# Altium schematic sheet altium-nano-debug.SchDoc
size A3; SheetNumber: 1; SheetTotal: 1
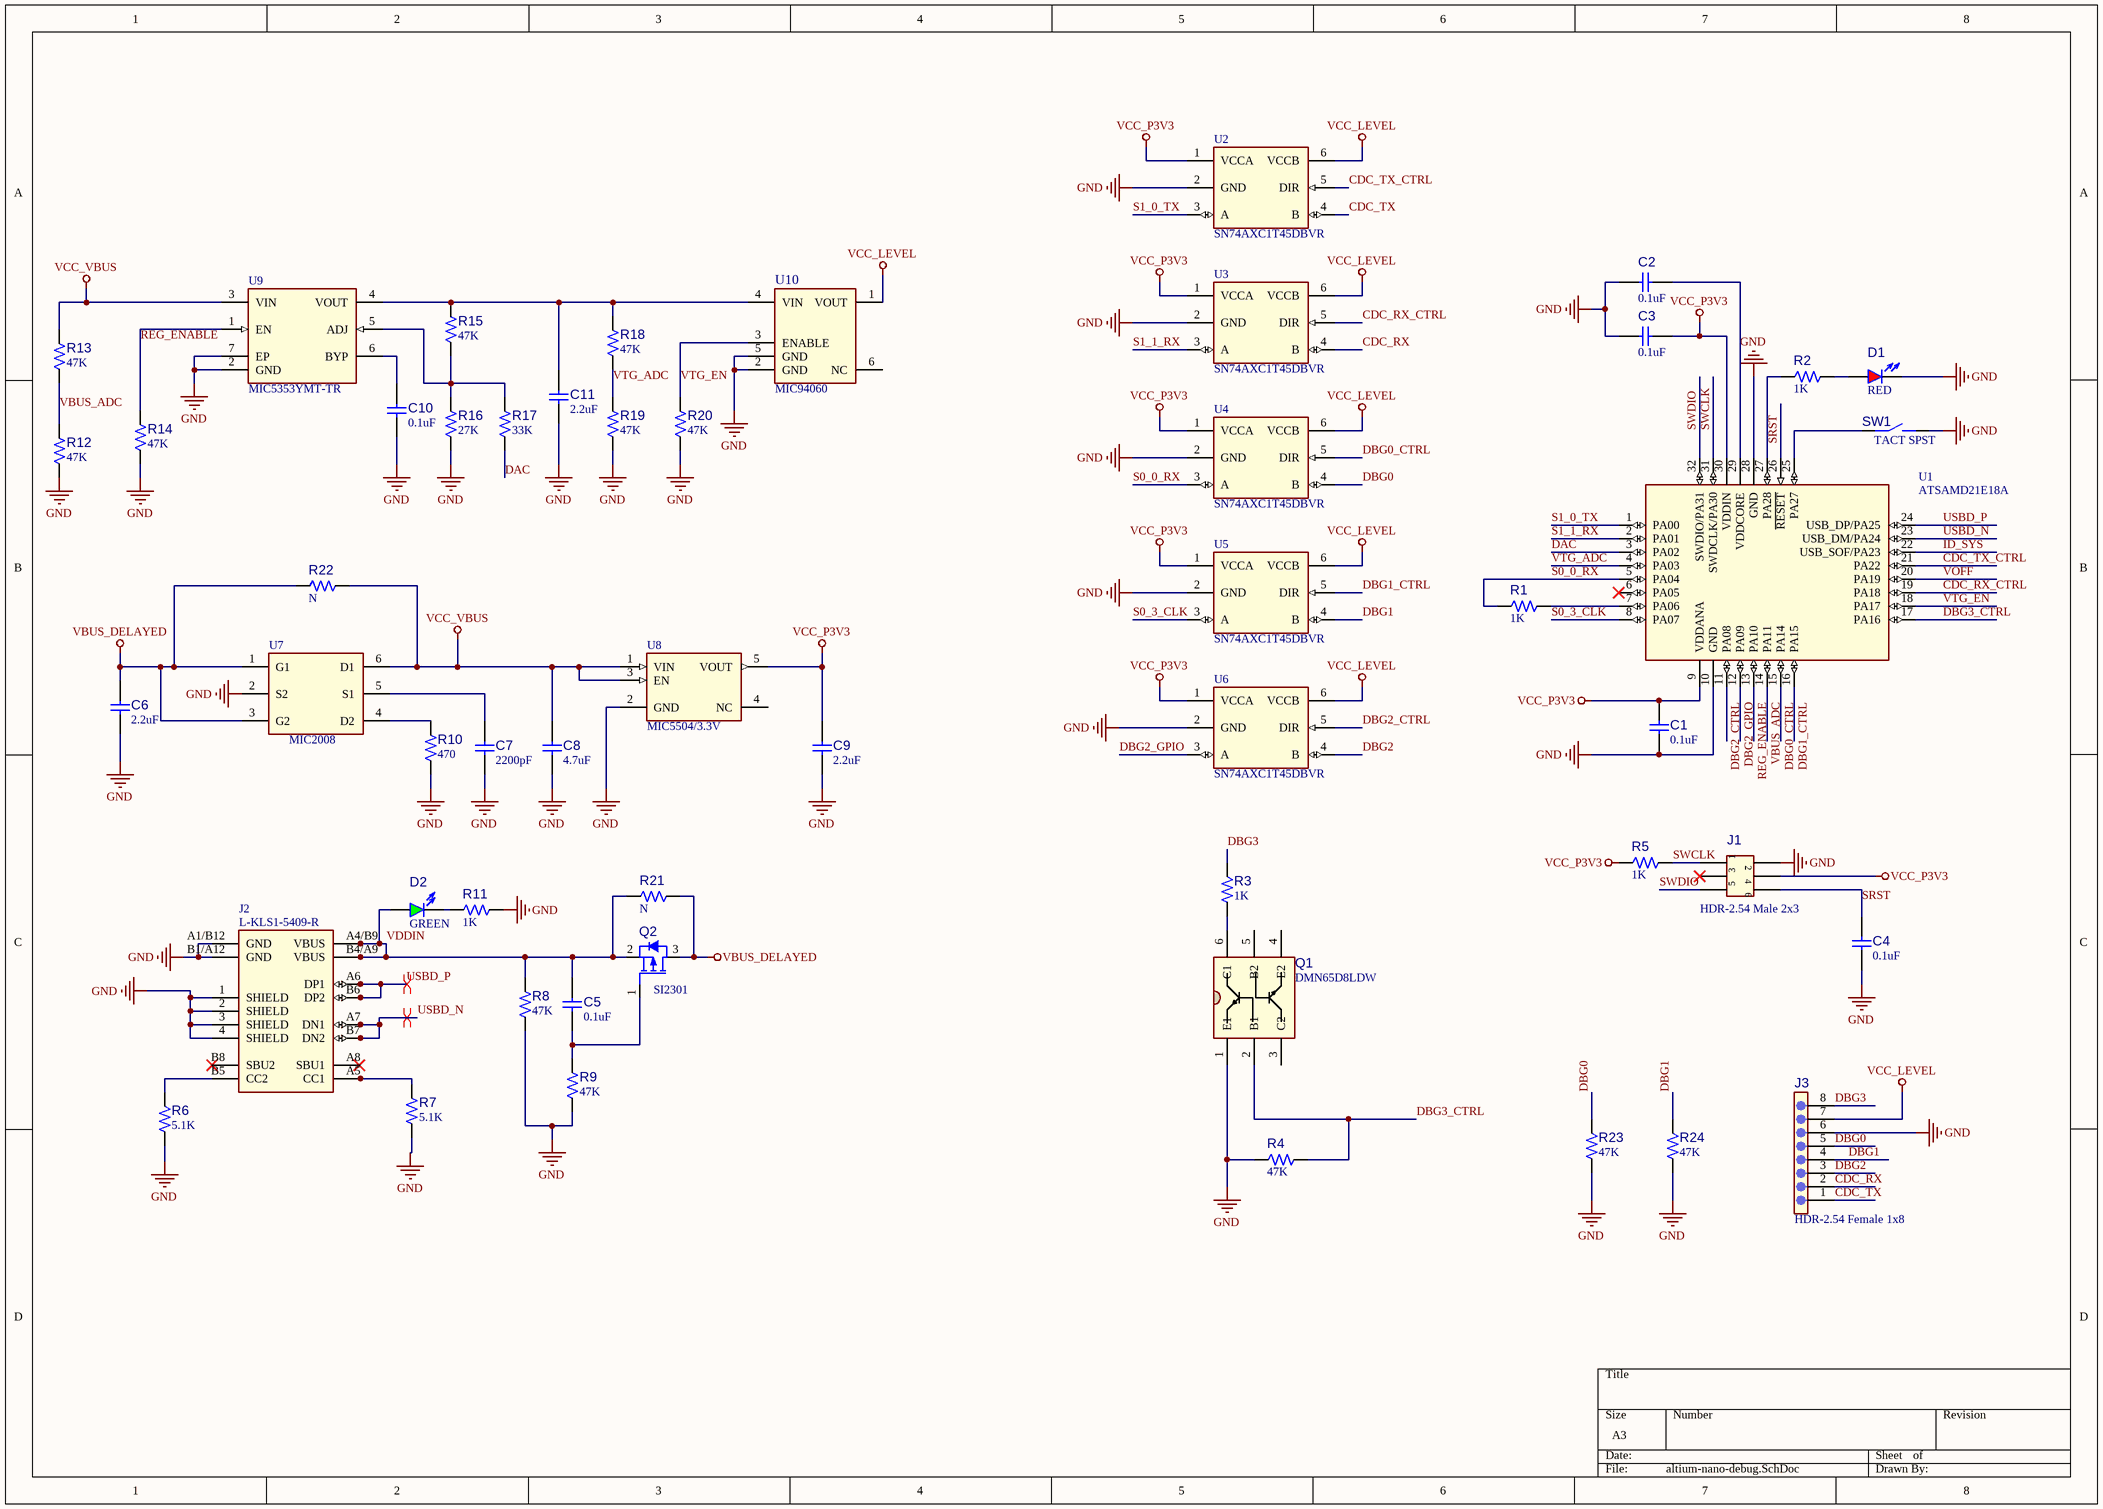
[diagram p0: altium-nano-debug.SchDoc]

## Parts
C1  value 0.1uF  [CAP_C_0603]  (hidden comment: Capacitor NP)
C2  value 0.1uF  [CAP_C_0603]  (hidden comment: Capacitor NP)
C3  value 0.1uF  [CAP_C_0603]  (hidden comment: Capacitor NP)
C4  value 0.1uF  [CAP_C_0603]  (hidden comment: Capacitor NP)
C5  value 0.1uF  [CAP_C_0603]  (hidden comment: Capacitor NP)
C6  value 2.2uF  [CAP_C_0603]  (hidden comment: Capacitor NP)
C7  value 2200pF  [CAP_C_0603]  (hidden comment: Capacitor NP)
C8  value 4.7uF  [CAP_C_0603]  (hidden comment: Capacitor NP)
C9  value 2.2uF  [CAP_C_0603]  (hidden comment: Capacitor NP)
C10  value 0.1uF  [CAP_C_0603]  (hidden comment: Capacitor NP)
C11  value 2.2uF  [CAP_C_0603]  (hidden comment: Capacitor NP)
D1  value RED  [LED_0603_Yellow]  (hidden comment: LED_red)
D2  value GREEN  [LED_0603_GREEN]  (hidden comment: LED_green)
J1  value HDR-2.54 Male 2x3  [HDR_M_2.54_2x3]  (hidden comment: Header 2x3)
J2  Manufacturer Part Number 1: L-KLS1-5409-R  [CON_USB2.0-C_RCPT_SMD_RA_KLS_KLS1-5409]  (hidden comment: CON USB2.0-C RCPT SMD RA KLS KLS1-5409)
J3  value HDR-2.54 Female 1x8  [HDR_F_2.54_1x8_RA]  (hidden comment: Header 1x8)
Q1  value DMN65D8LDW  [SOT-363]  (hidden comment: BC847BS-7-F SOT-363)
Q2  value SI2301  [SOT-23-3]  (hidden comment: Transistor MOS-P GSD)
R1  value 1K  [RES_C_0603]  (hidden comment: Resistor)
R2  value 1K  [RES_C_0603]  (hidden comment: Resistor)
R3  value 1K  [RES_C_0603]  (hidden comment: Resistor)
R4  value 47K  [RES_C_0603]  (hidden comment: Resistor)
R5  value 1K  [RES_C_0603]  (hidden comment: Resistor)
R6  value 5.1K  [RES_C_0603]  (hidden comment: Resistor)
R7  value 5.1K  [RES_C_0603]  (hidden comment: Resistor)
R8  value 47K  [RES_C_0603]  (hidden comment: Resistor)
R9  value 47K  [RES_C_0603]  (hidden comment: Resistor)
R10  value 470  [RES_C_0603]  (hidden comment: Resistor)
R11  value 1K  [RES_C_0603]  (hidden comment: Resistor)
R12  value 47K  [RES_C_0603]  (hidden comment: Resistor)
R13  value 47K  [RES_C_0603]  (hidden comment: Resistor)
R14  value 47K  [RES_C_0603]  (hidden comment: Resistor)
R15  value 47K  [RES_C_0603]  (hidden comment: Resistor)
R16  value 27K  [RES_C_0603]  (hidden comment: Resistor)
R17  value 33K  [RES_C_0603]  (hidden comment: Resistor)
R18  value 47K  [RES_C_0603]  (hidden comment: Resistor)
R19  value 47K  [RES_C_0603]  (hidden comment: Resistor)
R20  value 47K  [RES_C_0603]  (hidden comment: Resistor)
R21  value N  [RES_C_0603]  (hidden comment: Resistor)
R22  value N  [RES_C_0603]  (hidden comment: Resistor)
R23  value 47K  [RES_C_0603]  (hidden comment: Resistor)
R24  value 47K  [RES_C_0603]  (hidden comment: Resistor)
SW1  value TACT SPST  [SW_TACT_SMD_CK_KSR231GLFS]  (hidden comment: Switch 2 Pin)
U1  value ATSAMD21E18A  [TQFP-32_7x7]  (hidden comment: ATSAMD21E TQFP-32)
U2  value SN74AXC1T45DBVR  [SOT-23-6]  (hidden comment: SN74LVC1T45MDCKREP SC-70-6)
U3  value SN74AXC1T45DBVR  [SOT-23-6]  (hidden comment: SN74LVC1T45MDCKREP SC-70-6)
U4  value SN74AXC1T45DBVR  [SOT-23-6]  (hidden comment: SN74LVC1T45MDCKREP SC-70-6)
U5  value SN74AXC1T45DBVR  [SOT-23-6]  (hidden comment: SN74LVC1T45MDCKREP SC-70-6)
U6  value SN74AXC1T45DBVR  [SOT-23-6]  (hidden comment: SN74LVC1T45MDCKREP SC-70-6)
U7  value MIC2008  [SOT-23-6]  (hidden comment: AM3906N SOT23-6)
U8  value MIC5504/3.3V  [SOT-23-5]  (hidden comment: MIC55XX-X.X SOT23-5)
U9  value MIC5353YMT-TR  [MLF-6 1.6X1.6mm]  (hidden comment: MIC53XX ADJ MLF-6)
U10  value MIC94060  [SC-70-6]  (hidden comment: MIC94060Y-SC70-6)

## Nets
GND: C1.1 C2.1 C3.1 C4.1 C6.2 C7.2 C8.2 C9.2 C10.2 C11.2 D1.2(K) J1.2 J2.1(SHIELD) J2.2(SHIELD) J2.3(SHIELD) J2.4(SHIELD) J2.A1/B12(GND) J2.B1/A12(GND) J3.6 Q1.1(E1) R4.1 R6.2 R7.2 R8.1 R9.1 R10.1 R11.1 R12.1 R14.1 R16.1 R19.1 R20.1 R23.1 R24.1 SW1.2 U1.10(GND) U1.28(GND) U2.2(GND) U3.2(GND) U4.2(GND) U5.2(GND) U6.2(GND) U7.2(S2) U8.2(GND) U9.2(GND) U9.7(EP) U10.2(GND) U10.5(GND)
VBUS_DELAYED: C6.1 Q2.3(D) R21.1 R22.2 U7.1(G1) U7.3(G2)
VCC_LEVEL: J3.7 U2.6(VCCB) U3.6(VCCB) U4.6(VCCB) U5.6(VCCB) U6.6(VCCB) U10.1(VOUT)
VCC_P3V3: C1.2 C3.2 C9.1 J1.4 R5.2 U1.9(VDDANA) U1.30(VDDIN) U2.1(VCCA) U3.1(VCCA) U4.1(VCCA) U5.1(VCCA) U6.1(VCCA) U8.5(VOUT)
VCC_VBUS: C8.1 R13.2 R22.1 U7.6(D1) U8.1(VIN) U8.3(EN) U9.3(VIN)
CDC_RX: J3.2 U3.4(B)
CDC_RX_CTRL: U1.19(PA18) U3.5(DIR)
CDC_TX: J3.1 U2.4(B)
CDC_TX_CTRL: U1.21(PA22) U2.5(DIR)
DAC: R17.2 U1.3(PA02)
DBG0: J3.5 R23.2 U4.4(B)
DBG0_CTRL: U1.15(PA14) U4.5(DIR)
DBG1: J3.4 R24.2 U5.4(B)
DBG1_CTRL: U1.16(PA15) U5.5(DIR)
DBG2: J3.3 U6.4(B)
DBG2_CTRL: U1.11(PA08) U6.5(DIR)
DBG2_GPIO: U1.12(PA09) U6.3(A)
DBG3: J3.8 R3.2
DBG3_CTRL: Q1.2(B1) R4.2 U1.17(PA16)
ID_SYS: U1.22(USB_SOF/PA23)
REG_ENABLE: R14.2 U1.13(PA10) U9.1(EN)
S0_0_RX: R1.1 U1.5(PA04) U4.3(A)
S0_3_CLK: U1.8(PA07) U5.3(A)
S1_0_TX: U1.1(PA00) U2.3(A)
S1_1_RX: U1.2(PA01) U3.3(A)
SRST: C4.2 J1.6 U1.26(~{RESET})
SWCLK: J1.1 R5.1 U1.31(SWDCLK/PA30)
SWDIO: J1.5 U1.32(SWDIO/PA31)
USBD_N: J2.A7(DN1) J2.B7(DN2) U1.23(USB_DM/PA24)
USBD_P: J2.A6(DP1) J2.B6(DP2) U1.24(USB_DP/PA25)
VBUS_ADC: R12.2 R13.1 U1.14(PA11)
VDDIN: C5.1 D2.1(A) J2.A4/B9(VBUS) J2.B4/A9(VBUS) Q2.2(S) R8.2 R21.2
VOFF: U1.20(PA19)
VTG_ADC: R18.1 R19.2 U1.4(PA03)
VTG_EN: R20.2 U1.18(PA17) U10.3(ENABLE)
NetC2_2: C2.2 U1.29(VDDCORE)
NetC5_2: C5.2 Q2.1(G) R9.2
NetC7_1: C7.1 U7.5(S1)
NetC10_1: C10.1 U9.6(BYP)
NetC11_1: C11.1 R15.2 R18.2 U9.4(VOUT) U10.4(VIN)
NetD1_1: D1.1(A) R2.1
NetD2_2: D2.2(K) R11.2
NetJ2_A5: J2.A5(CC1) R7.1
NetJ2_B5: J2.B5(CC2) R6.1
NetQ1_6: Q1.6(C1) R3.1
NetR1_2: R1.2 U1.7(PA06)
NetR2_2: R2.2 U1.27(PA28)
NetR10_2: R10.2 U7.4(D2)
NetR15_1: R15.1 R16.2 R17.1 U9.5(ADJ)
NetSW1_1: SW1.1 U1.25(PA27)

Not connected (* = marked no-connect by the designer): J1 3*; J2 A8(SBU1) B8(SBU2)*; Q1 3(C2) 4(E2) 5(B2); U1 6(PA05)*; U8 4(NC); U10 6(NC)

## Layout directives
differential pair: USBD_N, USBD_P

## Library data of the parts
C1-C11 = CAP0455: Manufacturer 1: KYOCERA AVX; Manufacturer Part Number 1: 06035G104ZAT2A; Description_: CAP CER 0.1uF 50V 20% Y5V SMD 0603; Dev Tools Status: Production; Tolerance: 20%; Temperature Coefficient: Y5V; Type: Ceramic; Populated: Yes; Restricted Sourcing: No; MCHP-ID: CAP0455; Revision: 4; Symbol: Capacitor NP; Status: MCL Design; ComponentLink1URL: https://chn-vm-apps.microchip.com/mchprepo/parts/Datasheets/ECJ__General_.pdf; ComponentLink1Description: SVN Datasheet; ComponentLink2URL: C:\ALTIUM_WORK\00001_MCHP-CDB\Datasheets\ECJ__General_.pdf; ComponentLink2Description: Local Datasheet; ComponentLink3URL: C:\ALTIUM_WORK\00001_MCHP-CDB\Library\LibraryRefs\Capacitor NP.SchLib; ComponentLink3Description: Open Symbol; ComponentLink4URL: C:\ALTIUM_WORK\00001_MCHP-CDB\Library\Footprints\CAP_C_0603.PcbLib; ComponentLink4Description: Open Footprint; ComponentLink5Description: Open Footprint 2; ComponentLink6Description: Open Footprint 3; ComponentLink7Description: Open Footprint 4; Operating Temperature: -30C to +85C; Category: Capacitor; Manufacturer 2: Yageo; Manufacturer Part Number 2: CC0603ZRY5V9BB104; Supplier 1: Digi-Key; Supplier Part Number 1: 478-3724-1-ND; Supplier 2: Digi-Key; Supplier Part Number 2: 311-1343-6-ND; Supplier 3: Digi-Key; Supplier Part Number 3: 311-1343-2-ND; Quantity Override: 1
D1 = LED0049: LED; Manufacturer 1: Lite-On; Manufacturer Part Number 1: LTST-C150EKT; Description_: DIO LED RED 2V 30mA 6mcd Clear SMD 1206; Dev Tools Status: Production; Type: LED Single; Forward Current: 30mA; Power: 100mW; Reverse Current: 100uA; Reverse Voltage: 5V; Populated: YES; Restricted Sourcing: No; MCHP-ID: LED0049; Revision: 2; Symbol: LED_red; Status: MCL Design; Package: 1206; ComponentLink1URL: https://chn-vm-apps.microchip.com/mchprepo/parts/Datasheets/LTST-C150EKT.pdf; ComponentLink1Description: SVN Datasheet; ComponentLink2URL: C:\ALTIUM_WORK\00001_MCHP-CDB\Datasheets\LTST-C150EKT.pdf; ComponentLink2Description: Local Datasheet; ComponentLink3URL: C:\ALTIUM_WORK\00001_MCHP-CDB\Library\LibraryRefs\LED_red.SchLib; ComponentLink3Description: Open Symbol; ComponentLink4URL: C:\ALTIUM_WORK\00001_MCHP-CDB\Library\Footprints\LED_1206_Red.PcbLib; ComponentLink4Description: Open Footprint; ComponentLink5Description: Open Footprint 2; ComponentLink6Description: Open Footprint 3; ComponentLink7Description: Open Footprint 4; Operating Temperature: -55C to +85C; Category: Diode; Manufacturer 2: Kingbright; Manufacturer Part Number 2: KPC-3216EC-10MAV; Supplier 1: Digi-Key; Supplier Part Number 1: 160-1168-2-ND; Supplier 2: Kingbright; Supplier Part Number 2: KPC-3216EC-10MAV; Quantity Override: 1
D2 = DIODE1815: LED; Manufacturer 1: Vishay; Manufacturer Part Number 1: TLMP1100-GS08; Description_: DIO LED GREEN 2.1V 20mA SMD 0603 AEC-Q101; Dev Tools Status: Production; Forward Current: 20mA; Power: 90mW; Reverse Voltage: 12V; Owner: Severino Balong Jr.; Populated: YES; Restricted Sourcing: No; MCHP-ID: DIODE1815; Revision: 3; Symbol: LED_green; Status: MCL Design; Package: 0603; ComponentLink1URL: https://chn-vm-apps.microchip.com/mchprepo/parts/Datasheets/tlmx1100.pdf; ComponentLink1Description: SVN Datasheet; ComponentLink2URL: C:\ALTIUM_WORK\00001_MCHP-CDB\Datasheets\tlmx1100.pdf; ComponentLink2Description: Local Datasheet; ComponentLink3URL: C:\ALTIUM_WORK\00001_MCHP-CDB\Library\LibraryRefs\LED_green.SchLib; ComponentLink3Description: Open Symbol; ComponentLink4URL: C:\ALTIUM_WORK\00001_MCHP-CDB\Library\Footprints\LED_0603_GREEN.PcbLib; ComponentLink4Description: Open Footprint; ComponentLink5Description: Open Footprint 2; ComponentLink6Description: Open Footprint 3; ComponentLink7Description: Open Footprint 4; Operating Temperature: -40C to +100C; Category: Diode; Supplier 1: Digi-Key; Supplier Part Number 1: 751-1176-2-ND; Quantity Override: 1
J1 = CON0039: MCHP-ID: CON0039
J2 = CON2580: Manufacturer 1: KLS Electronic; Value: USB2.0 Type-C FEMALE; Description_: CON USB2.0 Type-C Female SMD R/A; Voltage: 100V AC; Current: 5A; Populated: YES; Restricted Sourcing: No; Revision: 2; Symbol: CON USB2.0-C RCPT SMD RA KLS KLS1-5409; Type: USB; Category: Connector; Supplier 1: Cabcon A/S; Supplier Part Number 1: L-KLS1-5409-R; Operating Temperature: -30C to +85C; Assembly Type: SMD
J3 = CON1288: Manufacturer 1: Sullins Connector Solutions; Manufacturer Part Number 1: PPPC081LGBN-RC; Description_: CON HDR-2.54 Female 1x8 Gold TH R/A; Dev Tools Status: Production; Owner: Bogdan Popescu; Populated: YES; Restricted Sourcing: No; MCHP-ID: CON1288; Revision: 4; Symbol: Header 1x8; Status: MCL Design; ComponentLink1URL: https://chn-vm-apps.microchip.com/mchprepo/parts/Datasheets/78_P(N)PxCxx1LGBN-RC,_10493-F.pdf; ComponentLink1Description: SVN Datasheet; ComponentLink2URL: C:\ALTIUM_WORK\00001_MCHP-CDB\Datasheets\78_P(N)PxCxx1LGBN-RC,_10493-F.pdf; ComponentLink2Description: Local Datasheet; ComponentLink3URL: C:\ALTIUM_WORK\00001_MCHP-CDB\Library\LibraryRefs\Header 1x8.SchLib; ComponentLink3Description: Open Symbol; ComponentLink4URL: C:\ALTIUM_WORK\00001_MCHP-CDB\Library\Footprints\HDR_F_2.54_1x8_RA.PcbLib; ComponentLink4Description: Open Footprint; ComponentLink5Description: Open Footprint 2; ComponentLink6Description: Open Footprint 3; ComponentLink7Description: Open Footprint 4; Type: Header 2.54mm; Category: Connector; Manufacturer 2: Greenconn Technology (Shenzhen) Co., Ltd.; Manufacturer Part Number 2: 2521 08 0001 2224; Manufacturer 3: SHENZHEN JUNHAO ENGINEERING; Manufacturer Part Number 3: R-212-0820-0021-000; Supplier 1: Digi-Key; Supplier Part Number 1: S5483-ND; Supplier 2: Greenconn Technology (Shenzhen) Co., Ltd.; Supplier Part Number 2: 2521 08 0001 2224; Supplier 3: SHENZHEN JUNHAO ENGINEERING; Supplier Part Number 3: R-212-0820-0021-000; Quantity Override: 1
Q1 = TRA1406: ADC; Manufacturer 1: Diodes Incorporated; Description_: TRANS 2NPN 45V 0.1A SOT363; Dev Tools Status: Design; Current: 100mA; Drain to Source Voltage: 5V; Gate to Source Voltage: 45V; Power: 200mW; Owner: Jose Garcia; Populated: YES; Restricted Sourcing: No; MCHP-ID: TRA1406; Revision: 1; Symbol: BC847BS-7-F SOT-363; Status: MCL Design; Package: SOT-363; ComponentLink1URL: https://chn-vm-apps.microchip.com/mchprepo/parts/Datasheets/https://www.diodes.com/assets/Datasheets/ds30222.pdf; ComponentLink1Description: SVN Datasheet; ComponentLink2URL: C:\ALTIUM_WORK\00001_MCHP-CDB\Datasheets\https://www.diodes.com/assets/Datasheets/ds30222.pdf; ComponentLink2Description: Local Datasheet; ComponentLink3URL: C:\ALTIUM_WORK\00001_MCHP-CDB\Library\LibraryRefs\BC847BS-7-F SOT-363.SchLib; ComponentLink3Description: Open Symbol; ComponentLink4URL: C:\ALTIUM_WORK\00001_MCHP-CDB\Library\Footprints\SOT-363.PcbLib; ComponentLink4Description: Open Footprint; ComponentLink5Description: Open Footprint 2; ComponentLink6Description: Open Footprint 3; ComponentLink7Description: Open Footprint 4; Operating Temperature: -65°C ~ 150°C (TJ); Category: Transistor; Manufacturer Part Number 1: BC847BS-7-F; Supplier 1: Digi-Key; Supplier Part Number 1: BC847BS-7FDICT-ND; Quantity Override: 1
Q2 = TRA0048: Transistor MOS; Manufacturer 1: Infineon; Manufacturer Part Number 1: IRLML6402TRPBF; Description_: TRANS FET P-CH IRLML6402 -20V -3.7A 1.3W SOT-23-3; Dev Tools Status: Production; Type: FET; Current: -3.7A; Drain to Source Voltage: -20V; Gate to Source Voltage: 12V; Power: 1.3W; Populated: YES; MCHP-ID: TRA0048; Revision: 3; Symbol: Transistor MOS-P GSD; Status: MCL Design; Package: SOT-23-3; ComponentLink1URL: https://chn-vm-apps.microchip.com/mchprepo/parts/Datasheets/irlml6402.pdf; ComponentLink1Description: SVN Datasheet; ComponentLink2URL: C:\ALTIUM_WORK\00001_MCHP-CDB\Datasheets\irlml6402.pdf; ComponentLink2Description: Local Datasheet; ComponentLink3URL: C:\ALTIUM_WORK\00001_MCHP-CDB\Library\LibraryRefs\Transistor MOS-P GSD.SchLib; ComponentLink3Description: Open Symbol; ComponentLink4URL: C:\ALTIUM_WORK\00001_MCHP-CDB\Library\Footprints\SOT-23-3.PcbLib; ComponentLink4Description: Open Footprint; ComponentLink5Description: Open Footprint 2; ComponentLink6Description: Open Footprint 3; ComponentLink7Description: Open Footprint 4; Operating Temperature: -55C to +150C; Category: Transistor; Supplier 1: Digi-Key; Supplier Part Number 1: IRLML6402PBFTR-ND; Quantity Override: 1
R1-R24 = RES0193: Manufacturer 1: Vishay; Manufacturer Part Number 1: CRCW0603100RJNEA; Description_: RES TKF 100R 5% 1/10W SMD 0603; Dev Tools Status: Production; Voltage: 50V; Temperature Coefficient: 100ppm/C; Power: 1/10W; Populated: Yes; MCHP-ID: RES0193; Revision: 2; Symbol: Resistor; Status: MCL Design; ComponentLink1URL: https://chn-vm-apps.microchip.com/mchprepo/parts/Datasheets/mcr_a.pdf; ComponentLink1Description: SVN Datasheet; ComponentLink2URL: C:\ALTIUM_WORK\00001_MCHP-CDB\Datasheets\mcr_a.pdf; ComponentLink2Description: Local Datasheet; ComponentLink3URL: C:\ALTIUM_WORK\00001_MCHP-CDB\Library\LibraryRefs\Resistor.SchLib; ComponentLink3Description: Open Symbol; ComponentLink4URL: C:\ALTIUM_WORK\00001_MCHP-CDB\Library\Footprints\RES_C_0603.PcbLib; ComponentLink4Description: Open Footprint; ComponentLink5Description: Open Footprint 2; ComponentLink6Description: Open Footprint 3; ComponentLink7Description: Open Footprint 4; Operating Temperature: -55C to +155C; Category: Resistor; Type: RES SMD; Composition: TKF; Supplier 1: Digi-Key; Supplier Part Number 1: 541-100GCT-ND; Quantity Override: 1
SW1 = SWITCH1050: Switch; Manufacturer 1: TE Connectivity; Manufacturer Part Number 1: 147873-2; Description_: SWITCH TACT SPST 24V 50mA KSR231GLFS SMD 6X3.5mm; Dev Tools Status: Production; Owner: Jamus Griego; Voltage: 24V; Current: 50mA; Populated: YES; MCHP-ID: SWITCH1050; Revision: 3; Symbol: Switch 2 Pin; Status: MCL Design; ComponentLink1URL: https://chn-vm-apps.microchip.com/mchprepo/parts/Datasheets/ENG_CD_147873_K3.pdf; ComponentLink1Description: SVN Datasheet; ComponentLink2URL: C:\ALTIUM_WORK\00001_MCHP-CDB\Datasheets\ENG_CD_147873_K3.pdf; ComponentLink2Description: Local Datasheet; ComponentLink3URL: C:\ALTIUM_WORK\00001_MCHP-CDB\Library\LibraryRefs\Switch 2 Pin.SchLib; ComponentLink3Description: Open Symbol; ComponentLink4URL: C:\ALTIUM_WORK\00001_MCHP-CDB\Library\Footprints\SW_TACT_SMD_CK_KSR231GLFS.PcbLib; ComponentLink4Description: Open Footprint; ComponentLink5Description: Open Footprint 2; ComponentLink6Description: Open Footprint 3; ComponentLink7Description: Open Footprint 4; Operating Temperature: -40C to +85C; Category: Switch; Type: Tactile; Manufacturer 2: Wuerth Elektronik; Manufacturer Part Number 2: 434123043836; Supplier 1: Digi-Key; Supplier Part Number 1: 450-2049-1-ND; Supplier 2: Digi-Key; Supplier Part Number 2: 732-7052-1-ND; Quantity Override: 1
U1 = IC2982: Microcontroller; Manufacturer 1: Microchip Technology; Manufacturer Part Number 1: ATSAMD21E18A-AUT; MCHP-ID: IC2982; Description_: MCHP MCU 32-BIT 48MHz 256Kb 32Kb ATSAMD21E18A-AUT TQFP-32; Dev Tools Status: Production; Owner: Vegard  Leksas; Populated: YES; Restricted Sourcing: No; Symbol: ATSAMD21E TQFP-32; Type: 32-Bit; Status: MCL Design; Revision: 1; Category: MCHP-Microcontroller; ComponentLink1URL: https://www.microchip.com/sitesearch/search/Product%20and%20Development%20Tools/ATSAMD21E18A-AUT; ComponentLink1Description: SVN Datasheet; ComponentLink2Description: Local Datasheet; ComponentLink3URL: C:\ALTIUM_WORK\00001_MCHP-CDB\Library\LibraryRefs\ATSAMD21E TQFP-32.SchLib; ComponentLink3Description: Open Symbol; ComponentLink4URL: C:\ALTIUM_WORK\00001_MCHP-CDB\Library\Footprints\TQFP-32_7x7.PcbLib; ComponentLink4Description: Open Footprint; ComponentLink5Description: Open Footprint 2; ComponentLink6Description: Open Footprint 3; ComponentLink7Description: Open Footprint 4; Supplier 1: Microchip Technology; Supplier Part Number 1: ATSAMD21E18A-AUT; Operating Temperature: -40C to +85C; Quantity Override: 1
U2-U6 = IC2143: Manufacturer 1: Texas Instruments; MCHP-ID: IC2143; Description_: IC TRANSLATOR SN74AXC1T45DBVR Voltage Level Translator Bidirectional SOT-23-6; Dev Tools Status: Production; Vin: 0.65 V ~ 3.6 V; Owner: Dragos Danaila; Populated: YES; Restricted Sourcing: No; Revision: 2; Symbol: SN74LVC1T45MDCKREP SC-70-6; Status: MCL Design; Package: SOT-23-6; ComponentLink1URL: https://chn-vm-apps.microchip.com/mchprepo/parts/Datasheets/sn74axc1t45.pdf; ComponentLink1Description: SVN Datasheet; ComponentLink2URL: C:\ALTIUM_WORK\00001_MCHP-CDB\Datasheets\sn74axc1t45.pdf; ComponentLink2Description: Local Datasheet; ComponentLink3URL: C:\ALTIUM_WORK\00001_MCHP-CDB\Library\LibraryRefs\SN74LVC1T45MDCKREP SC-70-6.SchLib; ComponentLink3Description: Open Symbol; ComponentLink4URL: C:\ALTIUM_WORK\00001_MCHP-CDB\Library\Footprints\SOT-23-6.PcbLib; ComponentLink4Description: Open Footprint; ComponentLink5Description: Open Footprint 2; ComponentLink6Description: Open Footprint 3; ComponentLink7Description: Open Footprint 4; Operating Temperature: -40C to +125C; Type: Translator; Category: IC; Manufacturer Part Number 1: SN74AXC1T45DBVR; Supplier 1: Digi-Key; Supplier Part Number 1: 296-47598-2-ND; Quantity Override: 1
U7 = TRA1439: Manufacturer 1: Analog Power; Description_: AM3906N Dual N-Channel Logical Level MOSFET; Dev Tools Status: Design; Owner: Jose Garcia; Populated: YES; MCHP-ID: TRA1439; Revision: 2; Symbol: AM3906N SOT23-6; Status: MCL Design; Package: SOT23-6; ComponentLink1URL: https://chn-vm-apps.microchip.com/mchprepo/parts/Datasheets/http://www.analogpowerinc.com/part.php?part1=AM3906N; ComponentLink1Description: SVN Datasheet; ComponentLink2URL: C:\ALTIUM_WORK\00001_MCHP-CDB\Datasheets\http://www.analogpowerinc.com/part.php?part1=AM3906N; ComponentLink2Description: Local Datasheet; ComponentLink3URL: C:\ALTIUM_WORK\00001_MCHP-CDB\Library\LibraryRefs\AM3906N SOT23-6.SchLib; ComponentLink3Description: Open Symbol; ComponentLink4URL: C:\ALTIUM_WORK\00001_MCHP-CDB\Library\Footprints\SOT-23-6.PcbLib; ComponentLink4Description: Open Footprint; ComponentLink5Description: Open Footprint 2; ComponentLink6Description: Open Footprint 3; ComponentLink7Description: Open Footprint 4; Operating Temperature: 25C to 70C; Category: Transistor; Type: FET; Manufacturer Part Number 1: AM3906N; Supplier 1: Analog Power; Supplier Part Number 1: AM3906N; Quantity Override: 1; Restricted Sourcing: Yes
U8 = MIC9419: Manufacturer 1: Microchip Technology; Manufacturer Part Number 1: MIC5504-3.3YM5-TR; Description_: MCHP ANALOG LDO 3.3V 300mA MIC5504-3.3YM5-TR SOT23-5; Dev Tools Status: Production; Owner: Cristina Salanti; Populated: YES; Restricted Sourcing: No; MCHP-ID: MIC9419; Symbol: MIC55XX-X.X SOT23-5; Type: LDO; Status: MCL Design; Revision: 1; Category: MCHP-Analog; ComponentLink1URL: https://www.microchip.com/sitesearch/search/Product%20and%20Development%20Tools/MIC5504-3.3YM5-TR; ComponentLink1Description: SVN Datasheet; ComponentLink2Description: Local Datasheet; ComponentLink3URL: C:\ALTIUM_WORK\00001_MCHP-CDB\Library\LibraryRefs\MIC55XX-X.X SOT23-5.SchLib; ComponentLink3Description: Open Symbol; ComponentLink4URL: C:\ALTIUM_WORK\00001_MCHP-CDB\Library\Footprints\SOT-23-5.PcbLib; ComponentLink4Description: Open Footprint; ComponentLink5Description: Open Footprint 2; ComponentLink6Description: Open Footprint 3; ComponentLink7Description: Open Footprint 4; Supplier 1: Microchip Technology; Supplier Part Number 1: MIC5504-3.3YM5-TR; Operating Temperature: -40C to +125C; Quantity Override: 1
U9 = MIC7389: LDO Regulator; Manufacturer 1: Microchip Technology; Description_: MCHP ANALOG LDO ADJ 500mA MIC5353YMT-TR MLF-6; Dev Tools Status: Production; Owner: Mark Loper; Populated: YES; Restricted Sourcing: No; MCHP-ID: MIC7389; Symbol: MIC53XX ADJ MLF-6; Type: LDO; Status: MCL Design; Revision: 2; Category: MCHP-Analog; ComponentLink1URL: https://www.microchip.com/sitesearch/search/Product%20and%20Development%20Tools/MIC5353YMT-TR; ComponentLink1Description: SVN Datasheet; ComponentLink2Description: Local Datasheet; ComponentLink3URL: C:\ALTIUM_WORK\00001_MCHP-CDB\Library\LibraryRefs\MIC53XX ADJ MLF-6.SchLib; ComponentLink3Description: Open Symbol; ComponentLink4URL: C:\ALTIUM_WORK\00001_MCHP-CDB\Library\Footprints\MLF-6 1.6X1.6mm.PcbLib; ComponentLink4Description: Open Footprint; ComponentLink5Description: Open Footprint 2; ComponentLink6Description: Open Footprint 3; ComponentLink7Description: Open Footprint 4; Manufacturer Part Number 1: MIC5353YMT-TR; Supplier 1: Digi-Key; Supplier Part Number 1: 576-3681-1-ND; Operating Temperature: -40C to +125C; Quantity Override: 1
U10 = MIC8764: Manufacturer 1: Microchip Technology; Manufacturer Part Number 1: MIC94060YC6-TR; Description_: MCHP ANALOG HIGH-SIDE LOAD SWITCH 2A MIC94060 SC70-6; Dev Tools Status: Production; Owner: Sam Charles; Populated: YES; Restricted Sourcing: No; Revision: 2; ComponentLink1Description: SVN Datasheet; ComponentLink2URL: C:\ALTIUM_WORK\00001_MCHP-CDB\Datasheets\mic94060.pdf; ComponentLink2Description: Local Datasheet; ComponentLink3URL: C:\ALTIUM_WORK\00001_MCHP-CDB\Library\LibraryRefs\MIC94060Y-SC70-6.SchLib; ComponentLink3Description: Open Symbol; ComponentLink4URL: C:\ALTIUM_WORK\00001_MCHP-CDB\Library\Footprints\SC-70-6.PcbLib; ComponentLink4Description: Open Footprint; ComponentLink5Description: Open Footprint 2; ComponentLink6Description: Open Footprint 3; ComponentLink7Description: Open Footprint 4; MCHP-ID: MIC8764; Symbol: MIC94060Y-SC70-6; Type: Power Switch; Status: MCL Design; Category: MCHP-Analog; ComponentLink1URL: https://chn-vm-apps.microchip.com/mchprepo/parts/Datasheets/mic94060.pdf; Supplier 1: Microchip Technology; Supplier Part Number 1: MIC94060YC6-TR; Operating Temperature: -40C to +125C; Quantity Override: 1